# Altium schematic sheet pca10156_sheet4_level_shifters.SchDoc: =BoardTitle+' - Level Shifters'
size A3; Organization: Nordic Semiconductor; DocumentNumber: 4; SheetNumber: 4; SheetTotal: 7; CompanyName: Nordic Semiconductor; DocumentSize: A4
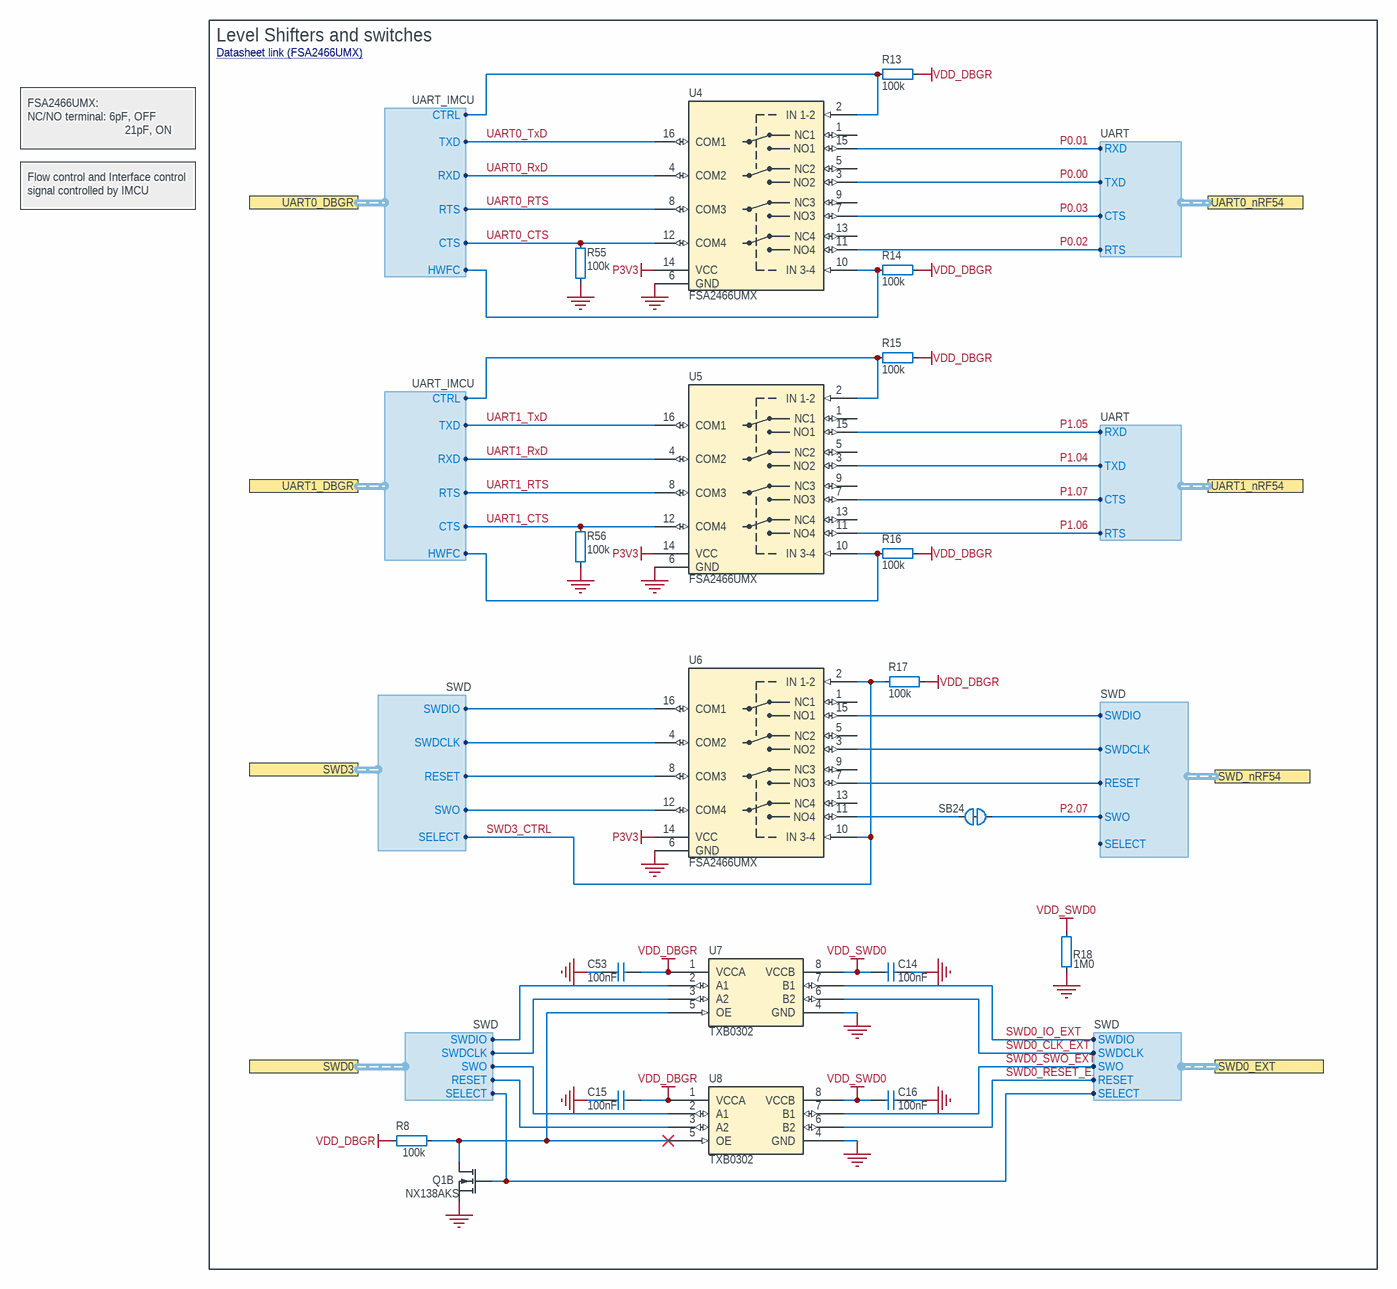
[diagram p0: pca10156_sheet4_level_shifters.SchDoc]

## Parts
C14  100nF  [CAPC0603X03L_C]
C15  100nF  [CAPC0603X03L_C]
C16  100nF  [CAPC0603X03L_C]
C53  100nF  [CAPC0603X03L_C]
Q1  NX138AKS  [TSSOP6]  (part B of 2)
R8  100k  [RESC0603X03L_C]
R13  100k  [RESC0603X03L_C]
R14  100k  [RESC0603X03L_C]
R15  100k  [RESC0603X03L_C]
R16  100k  [RESC0603X03L_C]
R17  100k  [RESC0603X03L_C]
R18  1M0  [RESC0603X03L_C]
R55  100k  [RESC0603X03L_C]
R56  100k  [RESC0603X03L_C]
SB24  Solderbridge  [Solderbridge_SHORTED_0.4]  (value not drawn)  (net tie, no BOM)
U4  FSA2466UMX  [XQFN40P180X260X50-16N]
U5  FSA2466UMX  [XQFN40P180X260X50-16N]
U6  FSA2466UMX  [XQFN40P180X260X50-16N]
U7  TXB0302  [XFDFN40P180X120X40-8M]
U8  TXB0302  [XFDFN40P180X120X40-8M]

## Ports
SWD0 (harness SWD), SWD0_EXT (harness SWD), SWD3 (harness SWD), SWD_nRF54 (harness SWD), UART0_DBGR (harness UART_IMCU), UART0_nRF54 (harness UART), UART1_DBGR (harness UART_IMCU), UART1_nRF54 (harness UART)

## Harnesses
SWD: SWDIO, SWDCLK, SWO, RESET, SELECT
UART_IMCU: RTS, CTS, RXD, TXD, HWFC, CTRL
UART: RTS, CTS, RXD, TXD

## Nets
GND: C14.2 C15.1 C16.2 C53.1 Q1.4(S2) R18.1 R55.2 R56.2 U4.6(GND) U5.6(GND) U6.6(GND) U7.4(GND) U8.4(GND)
P3V3: U4.14(VCC) U5.14(VCC) U6.14(VCC)
VDD_DBGR: C15.2 C53.2 R8.2 R13.1 R14.1 R15.1 R16.1 R17.1 U7.1(VCCA) U8.1(VCCA)
VDD_SWD0: C14.1 C16.1 R18.2 U7.8(VCCB) U8.8(VCCB)
P0.00: U4.3(NO2) ; port UART0_nRF54.TXD
P0.01: U4.15(NO1) ; port UART0_nRF54.RXD
P0.02: U4.11(NO4) ; port UART0_nRF54.RTS
P0.03: U4.7(NO3) ; port UART0_nRF54.CTS
P1.04: U5.3(NO2) ; port UART1_nRF54.TXD
P1.05: U5.15(NO1) ; port UART1_nRF54.RXD
P1.06: U5.11(NO4) ; port UART1_nRF54.RTS
P1.07: U5.7(NO3) ; port UART1_nRF54.CTS
P2.07: SB24.2 ; port SWD_nRF54.SWO
SWD0_CLK_EXT: U7.6(B2) ; port SWD0_EXT.SWDCLK
SWD0_IO_EXT: U7.7(B1) ; port SWD0_EXT.SWDIO
SWD0_RESET_EXT: U8.6(B2) ; port SWD0_EXT.RESET
SWD0_SWO_EXT: U8.7(B1) ; port SWD0_EXT.SWO
SWD3_CTRL: R17.2 U6.2(IN_1-2) U6.10(IN_3-4) ; port SWD3.SELECT
UART0_CTS: R55.1 U4.12(COM4) ; port UART0_DBGR.CTS
UART0_RTS: U4.8(COM3) ; port UART0_DBGR.RTS
UART0_RxD: U4.4(COM2) ; port UART0_DBGR.RXD
UART0_TxD: U4.16(COM1) ; port UART0_DBGR.TXD
UART1_CTS: R56.1 U5.12(COM4) ; port UART1_DBGR.CTS
UART1_RTS: U5.8(COM3) ; port UART1_DBGR.RTS
UART1_RxD: U5.4(COM2) ; port UART1_DBGR.RXD
UART1_TxD: U5.16(COM1) ; port UART1_DBGR.TXD
NetQ1_3: Q1.3(D2) R8.1 U7.5(OE) U8.5(OE)
NetQ1_5: Q1.5(G2) ; port SWD0.SELECT, port SWD0_EXT.SELECT
NetR13_2: R13.2 U4.2(IN_1-2) ; port UART0_DBGR.CTRL
NetR14_2: R14.2 U4.10(IN_3-4) ; port UART0_DBGR.HWFC
NetR15_2: R15.2 U5.2(IN_1-2) ; port UART1_DBGR.CTRL
NetR16_2: R16.2 U5.10(IN_3-4) ; port UART1_DBGR.HWFC
NetSB24_1: SB24.1 U6.11(NO4)
NetU6_3: U6.3(NO2) ; port SWD_nRF54.SWDCLK
NetU6_4: U6.4(COM2) ; port SWD3.SWDCLK
NetU6_7: U6.7(NO3) ; port SWD_nRF54.RESET
NetU6_8: U6.8(COM3) ; port SWD3.RESET
NetU6_12: U6.12(COM4) ; port SWD3.SWO
NetU6_15: U6.15(NO1) ; port SWD_nRF54.SWDIO
NetU6_16: U6.16(COM1) ; port SWD3.SWDIO
NetU7_2: U7.2(A1) ; port SWD0.SWDIO
NetU7_3: U7.3(A2) ; port SWD0.SWDCLK
NetU8_2: U8.2(A1) ; port SWD0.SWO
NetU8_3: U8.3(A2) ; port SWD0.RESET

Not connected (* = marked no-connect by the designer): U4 1(NC1) 5(NC2) 9(NC3) 13(NC4); U5 1(NC1) 5(NC2) 9(NC3) 13(NC4); U6 1(NC1) 5(NC2) 9(NC3) 13(NC4)

## Notes on the sheet
- Level Shifters and switches
- Datasheet link (FSA2466UMX) <https://www.onsemi.com/pdf/datasheet/fsa2466-d.pdf>
- FSA2466UMX:
  NC/NO terminal: 6pF, OFF
  21pF, ON
- Flow control and Interface control signal controlled by IMCU
- Title
- Size
- Date:
- File:
- A3
- PCB Assembly Number
- Sheet
- Drawn By:
- Revision
- of
- Classification:

## Library data of the parts
C14-C16 C53 = C0201-100n: Capacitor, X5R, ±10%; Manufacturer: N.A.; Part number IPS: 00000001248, 00000002505; Part number Norautron: 262071862; Part number NEMS: 100200078; Pad Count: 2; Note: 16V; Component Status: Active; Part Number: C0201-100n; Value: 100nF; Footprint Doc: 0201; Component Class: Capacitors; Author: rsk; PartId: 100200078; Manufacturer Part Number: N.A.; ComponentLink1URL: N.A.; ComponentLink1Description: Datasheet; ComponentLink2URL: N.A.; ComponentLink2Description: Supplier link; HelpURL: N.A.; LatestRevisionDate: 2017-11-09; Published: 2014-11-13; Supplier 1: N.A.; Supplier Part Number 1: N.A.; Supplier 2: N.A.; Supplier Part Number 2: N.A.; Artikkelnr Noca: N.A.
Q1 = NX138AKS: MOSFET 2N-CH 60V 0.17A TSSOP6 (SOT363); Manufacturer: Nexperia; Manufacturer Part Number: NX138AKSX; Part number NEMS: 101300207; Component Status: Active; Pad Count: 6; Note: N.A.; Part Number: NX138AKS; Component Class: Semiconductors; Author: stl1; ComponentLink1URL: https://assets.nexperia.com/documents/data-sheet/NX138AKS.pdf; ComponentLink1Description: Datasheet; ComponentLink2URL: N.A.; ComponentLink2Description: Supplier link; HelpURL: N.A.; LatestRevisionDate: 2023-11-20; Published: 2023-11-20; Footprint Doc: TSSOP6; Value: NX138AKS; Supplier 1: Digi-Key; Supplier Part Number 1: 1727-2732-2-ND; Supplier 2: Mouser; Supplier Part Number 2: 771-NX138AKSX; Artikkelnr Noca: N.A.; Part number IPS: N.A.; Part number Norautron: N.A.; PartId: 101300207
R8 R13-R17 R55 R56 = R0201-100k: Resistor, ±1%, 0.05W; Manufacturer: N.A.; Part number IPS: 00000001419; Part number Norautron: 26108487; Part number NEMS: 100100080; Note: Chip Res 1%; Pad Count: 2; Component Status: Active; Part Number: R0201-100k; Manufacturer Part Number: N.A.; ComponentLink1URL: N.A.; ComponentLink1Description: Datasheet; ComponentLink2URL: N.A.; ComponentLink2Description: Supplier link; HelpURL: N.A.; Footprint Doc: 0201; LatestRevisionDate: 2014-11-13; Published: 2014-11-13; Value: 100k; Artikkelnr Noca: N.A.; Supplier 1: N.A.; Supplier Part Number 1: N.A.; Supplier 2: N.A.; Supplier Part Number 2: N.A.; Component Class: Resistors; PartId: 100100080; Author: rsk
R18 = R0201-1M0: Resistor, ±1%, 0.05W; Manufacturer: N.A.; Part number IPS: 00000001418; Part number Norautron: 26107108; Part number NEMS: 100100093; Component Status: Active; Pad Count: 2; Note: Chip Res 1%; Part Number: R0201-1M0; PartId: 100100093; Component Class: Resistors; Author: rsk; Manufacturer Part Number: N.A.; ComponentLink1URL: N.A.; ComponentLink1Description: Datasheet; ComponentLink2URL: N.A.; ComponentLink2Description: Supplier link; HelpURL: N.A.; LatestRevisionDate: 2014-11-13; Published: 2014-11-13; Footprint Doc: 0201; Value: 1M0; Supplier 1: N.A.; Supplier Part Number 1: N.A.; Supplier 2: N.A.; Supplier Part Number 2: N.A.; Artikkelnr Noca: N.A.
SB24 = Solderbridge Shorted 0.4mm: Shorted Solderbridge; Manufacturer: N.A.; Part number NEMS: 100500561; Component Status: Active; Pad Count: 2; System: Connector; Part Number: Solderbridge Shorted 0.4mm; PartId: 100500561; Component Class: Connectors; Author: rsk; Manufacturer Part Number: N.A.; ComponentLink1URL: N.A.; ComponentLink1Description: Datasheet; ComponentLink2URL: N.A.; ComponentLink2Description: Supplier link; HelpURL: N.A.; LatestRevisionDate: 2012-08-07; Published: 2012-08-07; Footprint Doc: Solderbridge_Shorted; Value: Solderbridge; Note: N.A.; Supplier 1: N.A.; Supplier Part Number 1: N.A.; Supplier 2: N.A.; Supplier Part Number 2: N.A.; Artikkelnr Noca: N.A.; Part number IPS: N.A.; Part number Norautron: N.A.
U4-U6 = FSA2466UMX: Data / Audio Low-Voltage Dual DPDT Analog Switch; Manufacturer: ON Semiconductor; Part number IPS: 00000009986; Part number Norautron: 26500608; Part number NEMS: 101900422; Note: N.A.; Artikkelnr Noca: 15070069; Pad Count: 16; Component Status: Active; Part Number: FSA2466UMX; Manufacturer Part Number: FSA2466UMX; Footprint Doc: UFQFN-16; LatestRevisionDate: 2019-05-15; Published: 2016-05-18; Value: FSA2466UMX; ComponentLink1URL: N.A.; ComponentLink1Description: Datasheet; ComponentLink2URL: N.A.; ComponentLink2Description: Supplier link; HelpURL: https://www.onsemi.com/pub/Collateral/FSA2466-D.PDF; Supplier 1: Digi-Key; Supplier Part Number 1: FSA2466UMXCT-ND; Supplier 2: Mouser; Supplier Part Number 2: 512-FSA2466UMX; Component Class: Misc_ICs; PartId: 101900422; Author: rsk
U7 U8 = TXB0302DQMR: 2-bit bidirectional voltage-level translator with automatic direction sensing; Manufacturer: Texas Instruments; Part number NEMS: 101900198; Component Status: Active; Pad Count: 8; Note: Fully Symmetric Supply Voltages; Artikkelnr Noca: N.A.; Part Number: TXB0302DQMR; PartId: 101900198; Component Class: Misc_ICs; Author: rsk; Manufacturer Part Number: TXB0302DQMR; ComponentLink1URL: N.A.; ComponentLink1Description: Datasheet; ComponentLink2URL: N.A.; ComponentLink2Description: Supplier link; HelpURL: http://www.ti.com/lit/ds/symlink/txb0302.pdf; LatestRevisionDate: 2014-01-22; Published: 2014-01-22; Footprint Doc: XFDFN-8; Value: TXB0302; Supplier 1: Digi-Key; Supplier Part Number 1: 296-36871-1-ND; Supplier 2: Mouser; Supplier Part Number 2: 595-TXB0302DQMR; Part number IPS: N.A.; Part number Norautron: N.A.